# EAGLE design ufo (EAGLE 9.6.2)
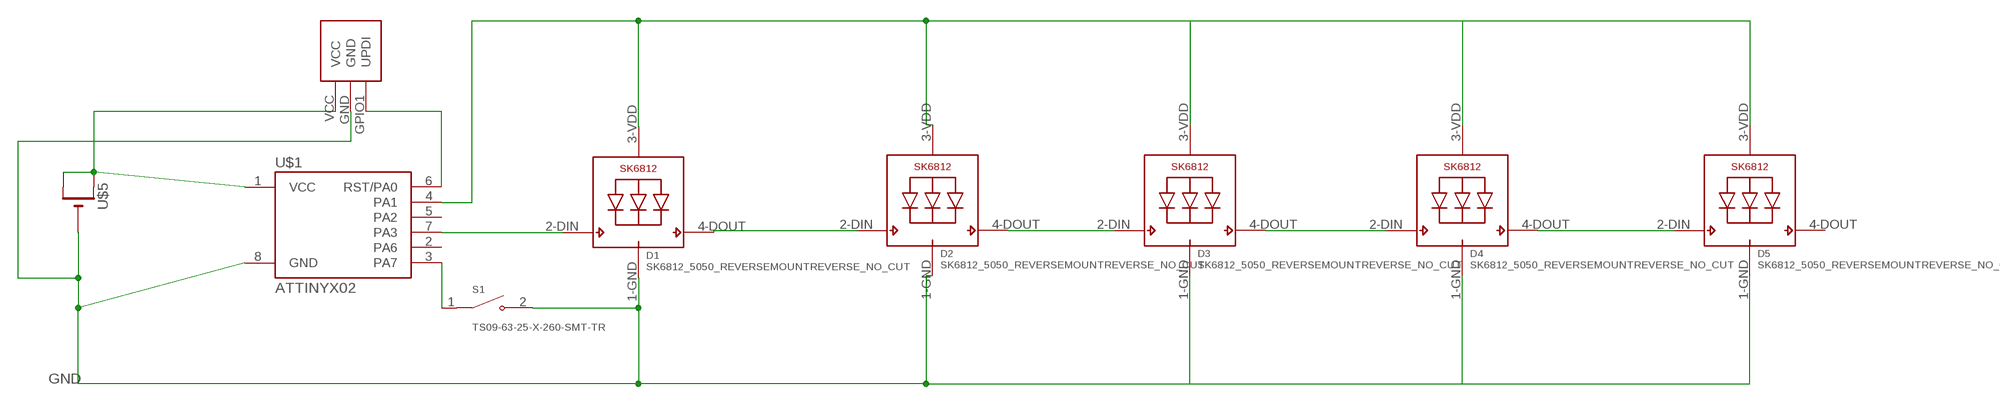
[diagram p0: schematic, sheet 1]

## Parts
D1  SK6812_5050_REVERSEMOUNTREVERSE_NO_CUT  [SK6812_REVERSE_NO_CUT]
D2  SK6812_5050_REVERSEMOUNTREVERSE_NO_CUT  [SK6812_REVERSE_NO_CUT]
D3  SK6812_5050_REVERSEMOUNTREVERSE_NO_CUT  [SK6812_REVERSE_NO_CUT]
D4  SK6812_5050_REVERSEMOUNTREVERSE_NO_CUT  [SK6812_REVERSE_NO_CUT]
D5  SK6812_5050_REVERSEMOUNTREVERSE_NO_CUT  [SK6812_REVERSE_NO_CUT]
S1  TS09-63-25-X-260-SMT-TR  [SW_TS09-63-25-X-260-SMT-TR]
U$1  ATTINYX02  [SOIC08_JEDEC_150MIL]
U$2  SAO  [SAO_SMD]
U$5  CR2032SMT  [CR2032-SMD]

## Nets
GND: D1.1-GND(GND) D2.1-GND(GND) D3.1-GND(GND) D4.1-GND(GND) D5.1-GND(GND) S1.2 U$1.8(GND) U$2.GND U$5.-
N$2: D1.4-DOUT(DO) D2.2-DIN(DI)
N$3: D1.2-DIN(DI) U$1.7(PA3)
N$5: D3.4-DOUT(DO) D4.2-DIN(DI)
N$6: D2.4-DOUT(DO) D3.2-DIN(DI)
N$7: S1.1 U$1.3(PA7)
N$8: D4.4-DOUT(DO) D5.2-DIN(DI)
N$110: U$1.6(RST/PA0) U$2.GPIO1(UPDI)
VCC1: U$1.1(VCC) U$2.VCC U$5.+$1(+) U$5.+$2(+1)
VDD1: D1.3-VDD(VDD) D2.3-VDD(VDD) D3.3-VDD(VDD) D4.3-VDD(VDD) D5.3-VDD(VDD) U$1.4(PA1)
Unconnected: D5.4-DOUT(DO) U$1.2(PA6) U$1.5(PA2)

## Library data of the parts
D1-D5 = mylibrary:SK6812_5050_REVERSEMOUNT
S1 = mylibrary:TS09-63-25-X-260-SMT-TR; MANUFACTURER: CUI Devices; MAXIMUM_PACKAGE_HEIGHT: 2.5 mm; PARTREV: 1.0; STANDARD: Manufacturer Recommendations
U$1 = mylibrary:ATTINYX02
U$2 = mylibrary:SAO
U$5 = adafruit:CR2032

## Board
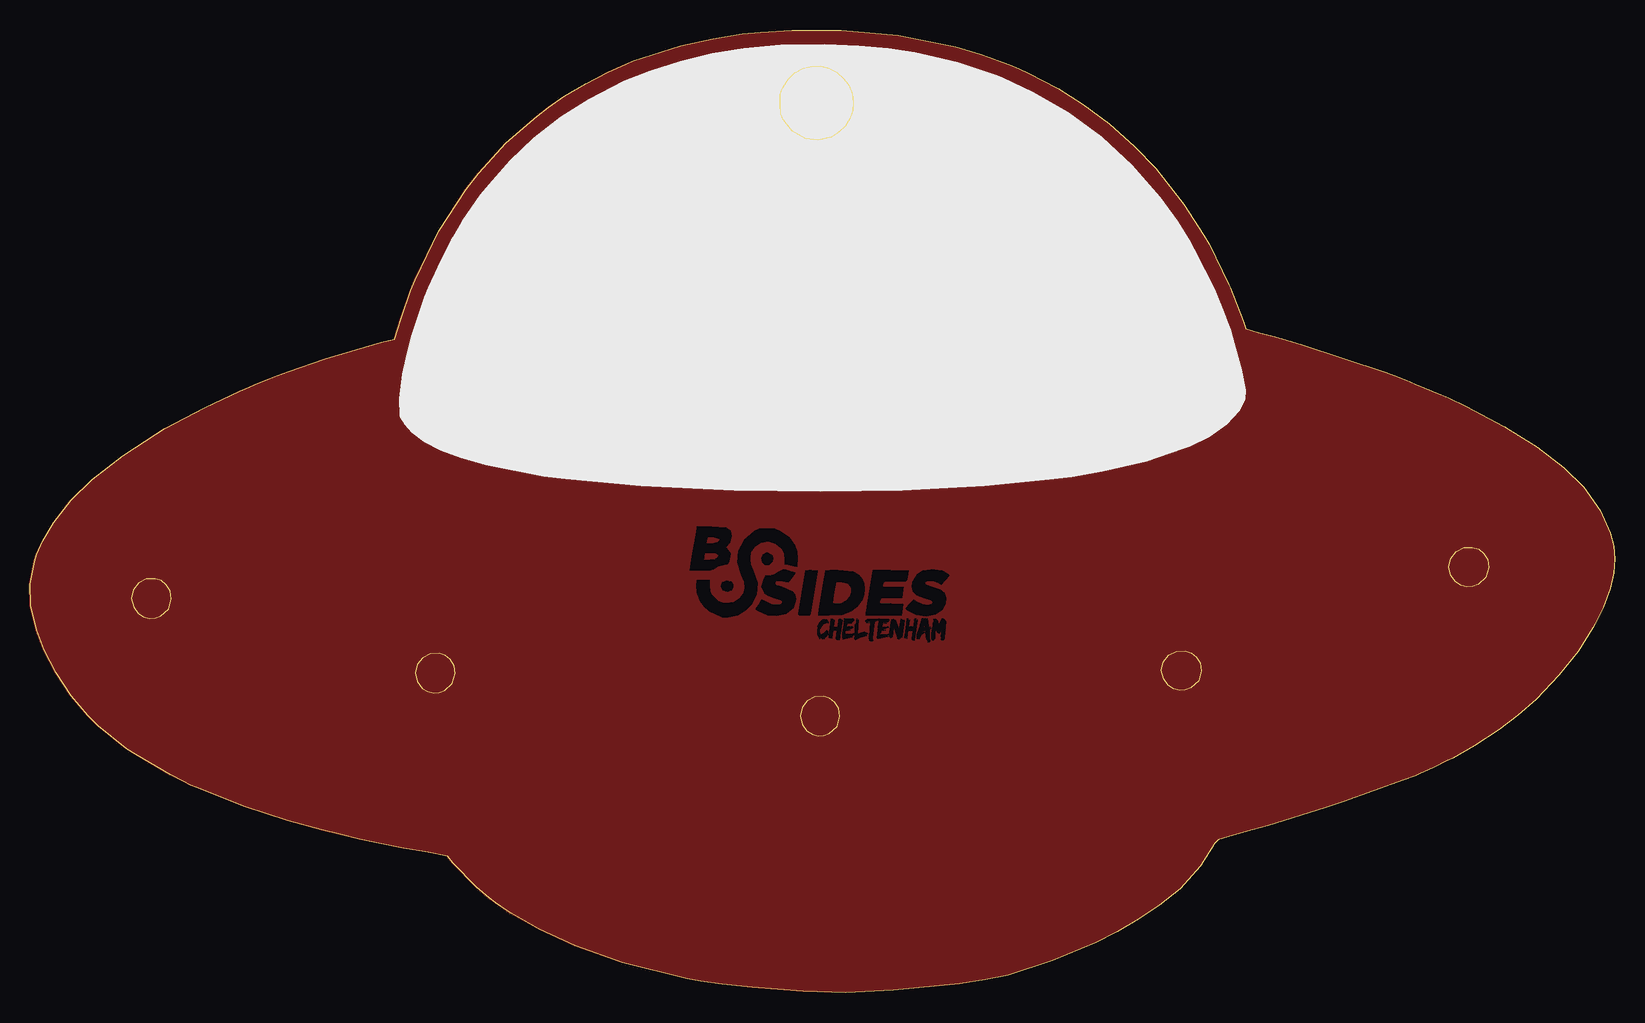
[diagram p1: board, top side]
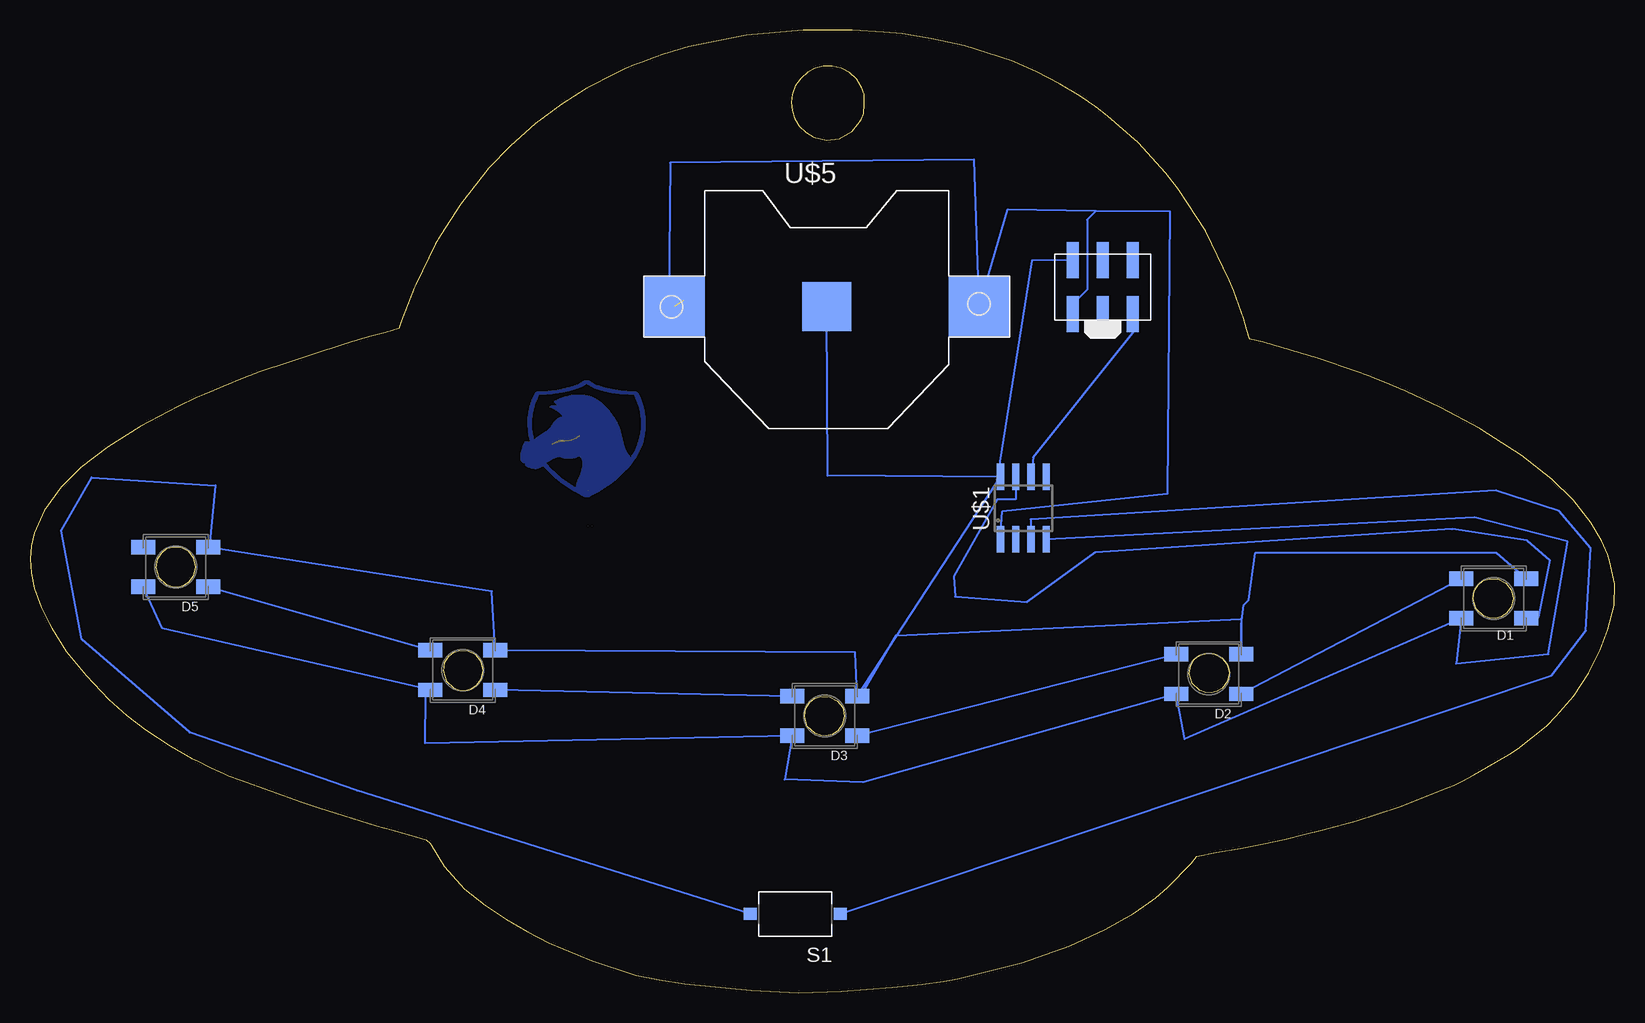
[diagram p2: board, bottom side, seen from below]

Size 132.05 x 80.26 mm. Coordinates in mm from the lower left corner, seen from the top.
Outline: 40.09,6.59 42.43,5.27 45.42,3.89 49.41,2.5 54.76,1.15 55.91,0.95 57.68,0.71 58.9,0.58 60.19,0.43 64.44,0.09 67.97,0 71.94,0.2 77.48,0.71 79.61,1.08 81.53,1.46 85.19,2.65 88.81,4.14 90.59,5.06 92.36,6.1 94.12,7.29 95.86,8.65 97.51,10.54 98.71,12.43 99.03,12.72 100.27,13.12 101.91,13.56 103.15,13.92 107.93,15.39 109.46,15.89 114.54,17.73 115.49,18.09 115.82,18.22 117.04,18.79 118.08,19.3 118.56,19.55 120.38,20.56 122.42,21.89 123.98,23.1 125.5,24.44 127.38,26.42 129.03,28.43 130.24,30.41 130.43,30.77 131.1,32.09 131.69,33.7 131.96,35 132.05,36.15 131.96,37.23 131.69,38.32 130.85,40.21 129.46,42.13 127.81,43.77 125.59,45.48 122.86,47.19 119.71,48.86 118.17,49.59 117.54,49.86 115.43,50.75 114.67,51.06 113.71,51.43 112.94,51.73 105.97,54.04 104.75,54.41 103.74,54.68 102.4,55.03 101.33,55.34 101.12,55.98 100.02,58.77 99.91,59.05 98.26,62.39 97.83,63.15 96.14,65.75 93.8,68.73 92.01,70.59 89.93,72.42 87.75,74.08 85.67,75.39 83.21,76.67 82.43,77.02 81.67,77.35 81.04,77.58 79.93,77.99 79.25,78.23 77.16,78.87 72.35,79.84 67.62,80.25 63.53,80.26 60.91,80.08 59.35,79.92 56.93,79.54 54.21,78.94 50.28,77.68 49.72,77.44 48.13,76.73 46.29,75.76 44.54,74.73 43.22,73.83 42.25,73.08 39.69,70.84 37.4,68.31 36.36,67 34.08,63.47 32.1,59.4 31.74,58.54 30.93,56.21 30.65,55.28 30.41,54.5 29.31,54.25 24.64,52.87 21.51,51.78 20.59,51.44 19.99,51.21 19.03,50.81 17.97,50.36 17.46,50.15 14.55,48.76 11.24,47.02 10.52,46.58 7.76,44.76 5.2,42.78 3.45,41.07 2,39.2 1.08,37.64 0.57,36.51 0.41,35.94 0,34.06 0.04,32.3 0.56,30.25 1.19,28.56 2.17,26.65 3.42,24.74 4.86,23.07 5.67,22.24 8.06,20.33 8.8,19.85 11.72,18.13 12.76,17.6 13.4,17.29 13.85,17.1 17.94,15.48 21.53,14.32 24.32,13.55 25.86,13.18 27.49,12.79 29.29,12.41 31.14,12.05 33.2,11.69 34.82,11.37 35.28,10.79 37.23,8.79 38.25,7.88 38.81,7.5 39.24,7.19 40.09,6.59
Outline: 40.09,6.59 40.09,6.59
Outline: 62.58,73.26 62.52,74.07 62.54,74.9 62.74,75.45 63.17,76.14 63.75,76.68 64.43,77.05 65.2,77.24 65.94,77.24 66.62,77.06 67.24,76.72 67.83,76.19 68.27,75.59 68.53,74.92 68.62,74.22 68.54,73.52 68.31,72.85 67.93,72.24 67.41,71.72 66.75,71.32 65.68,71.08 64.62,71.21 63.52,71.81 62.77,72.77 62.58,73.26
Outline: 8.62,33.58 8.46,32.87 8.63,32.16 9.03,31.6 9.49,31.33 9.97,31.21 10.44,31.23 10.91,31.41 11.55,31.99 11.78,32.82 11.68,33.47 11.35,34 10.94,34.34 10.43,34.5 9.7,34.47 9.06,34.14 8.62,33.58
Outline: 32.28,27.36 32.12,26.64 32.29,25.93 32.69,25.38 33.15,25.11 33.63,24.98 34.1,25.01 34.56,25.18 35.21,25.77 35.44,26.59 35.34,27.25 35.01,27.77 34.6,28.12 34.09,28.28 33.35,28.24 32.72,27.91 32.28,27.36
Outline: 64.34,23.78 64.18,23.07 64.35,22.36 64.75,21.8 65.21,21.53 65.69,21.41 66.16,21.43 66.63,21.61 67.27,22.19 67.5,23.02 67.4,23.67 67.07,24.2 66.66,24.54 66.15,24.7 65.41,24.67 64.78,24.34 64.34,23.78
Outline: 94.46,26.15 94.29,26.86 94.45,27.57 94.89,28.13 95.52,28.46 96.26,28.5 96.77,28.33 97.18,27.99 97.51,27.47 97.61,26.81 97.38,25.99 96.73,25.4 96.27,25.22 95.8,25.2 95.32,25.32 94.86,25.6 94.46,26.15
Outline: 118.41,34.78 118.23,35.49 118.4,36.2 118.84,36.76 119.47,37.09 120.21,37.12 120.71,36.96 121.13,36.62 121.46,36.1 121.55,35.44 121.32,34.62 120.68,34.03 120.22,33.85 119.74,33.83 119.27,33.95 118.8,34.23 118.41,34.78
Copper layers (1*16): Top 0.035mm / dielectric 1.5mm / Bottom 0.035mm
Design rules "default *": minimum track width 6mil, minimum drill 0.35mm, track to track 6mil, track to pad 6mil, pad to pad 6mil, via to via 6mil, smd to smd 6mil, copper to edge 0mil, drill to drill 6mil, minimum pad ring 10mil, minimum via ring 8mil, stop-mask expansion 4mil, vias tented up to drill 0mil, thermal gap 10mil
tRestrict: area 55.5,31.3 to 64,38.7; area 69.6,31.5 to 73.2,35.2; area 65.7,31.5 to 69.6,35.2; area 64,31.5 to 65.6,35.2; area 60.5,31.4 to 63.8,35.2; area 60.9,35.7 to 61.9,36.6; area 57.6,33.4 to 58.6,34.4; area 73,31.4 to 76.6,35.2; area 65.6,29.5 to 66.6,31.1; area 66.7,30.3 to 66.7,30.4; area 66.6,29.4 to 67.7,31.2; area 67.7,29.5 to 68.7,31.2; area 68.7,29.4 to 69.8,31.2; area 70,29.5 to 70,30; area 69.6,29.3 to 70.8,31.2; area 70.6,29.5 to 71.6,31.2; area 71.6,29.4 to 72.9,31.1; area 72.9,29.4 to 74,31.2; area 73.9,29.2 to 75.1,31.2; area 75.1,29.4 to 76.3,31.2; area 55,35.2 to 58.5,38.8; 208 lines
bRestrict: area 81.1,44.7 to 90.2,50.7; area 86.1,42.2 to 88.9,44.7

### Footprints (pad centres in the part's own frame; a part is rotated, then mirrored left to right if it is on the bottom)
SK6812_REVERSE_NO_CUT = smd 2 x 1.2: 1-GND -2.7,-1.65; 2-DIN -2.7,1.65; 3-VDD 2.7,1.65; 4-DOUT 2.7,-1.65
SW_TS09-63-25-X-260-SMT-TR = smd 1.1 x 1: 1 -3.75,0; 2 3.75,0
SOIC08_JEDEC_150MIL = smd 0.6 x 2.2: 1 -1.905,-2.6; 2 -0.635,-2.6; 3 0.635,-2.6; 4 1.905,-2.6; 5 1.905,2.6; 6 0.635,2.6; 7 -0.635,2.6; 8 -1.905,2.6
SAO_SMD = smd 1 x 3: GND 5.5,1.5; GPIO1 0.5,6; GPIO2 0.5,1.5; SCL 3,1.5; SDA 3,6; VCC 5.5,6
CR2032-SMD = smd 5.08 x 5.08: +$1 -12.7,0; +$2 12.7,0 | smd 4.064 x 4.064: - 0,0

### Placement (x,y rotation side)
D1  10.06,32.85 180 bottom
D2  33.82,26.55 180 bottom
D3  65.82,23.06 180 bottom
D4  95.98,26.88 180 bottom
D5  119.92,35.48 180 bottom
S1  68.28,6.55 180 bottom
U$1  49.28,40.39 0 bottom
U$2  39.65,62.55 180 bottom
U$5  65.65,57.19 0 bottom

### Tracks (layer width: path | path; a pad name or v marks a point on that pad's centre or on a via)
GND
  Bottom 0.152: D1.1-GND 9.85,36.67 29.94,36.67 30.49,32.73 30.89,32.33 31.12,30.7 D2.1-GND 31.12,31.16 59.87,29.8 62.46,25.37 D3.1-GND | D3.1-GND 51.54,42.44 | 51.54,42.44 U$1.8 65.57,43.09 65.65,56.88 | 65.65,56.88 U$5.- | 66.24,57.01 65.65,56.88 | D3.1-GND 63.3,28.37 D4.1-GND 93.57,33.46 117.12,37.11 | 117.12,37.11 D5.1-GND | S1.2 104.82,16.86 118.75,21.68 127.72,29.44 129.47,38.54 126.92,42.96 116.61,42.29 117.12,37.11 | U$2.GND 48.56,61.03 51.54,42.44
N$2
  Bottom 0.152: D1.4-DOUT D2.2-DIN
N$3
  Bottom 0.152: U$1.7 49.91,41.12 51.44,41.12 55.07,34.7 54.96,33.01 48.97,32.55 43.29,36.71 13.54,38.64 7.3,37.71 5.39,36.06 6.35,31.3 D1.2-DIN
N$5
  Bottom 0.152: D3.4-DOUT D4.2-DIN
N$6
  Bottom 0.152: D2.4-DOUT D3.2-DIN
N$7
  Bottom 0.152: S1.1 5.25,26.45 2.39,30.16 2,37.05 4.64,40.15 9.9,41.88 48.66,39.45 48.64,39.33 U$1.3
N$8
  Bottom 0.152: D4.4-DOUT D5.2-DIN
N$9
  pour Bottom: 80.83,48.05 80.81,47.51 80.82,46.95 80.86,46.55 80.94,46.16 81.04,45.79 81.18,45.42 81.35,45.05 81.55,44.69 81.78,44.34 82.04,44 82.29,43.7 82.6,43.38 82.93,43.06 83.25,42.78 83.72,42.41 84.23,42.06 84.79,41.71 85.37,41.39 85.49,41.32 85.67,41.32 85.84,41.32 85.97,41.39 85.97,41.39 86.65,41.77 87.24,42.15 87.78,42.54 88.28,42.95 88.74,43.4 89.15,43.83 89.23,43.93 89.33,43.87 89.52,43.77 89.71,43.69 89.88,43.64 90.01,43.63 90.27,43.69 90.56,43.81 90.68,43.88 90.74,43.95 90.75,44.02 90.74,44.09 90.74,44.11 90.76,44.11 90.9,44.16 91,44.24 91.06,44.33 91.1,44.45 91.12,44.55 91.13,44.69 91.11,44.93 91.05,45.22 90.94,45.59 90.82,45.86 90.77,45.92 90.7,45.95 90.62,45.95 90.54,45.9 90.5,45.87 90.34,45.97 90.37,46.09 90.45,46.44 90.5,46.83 90.52,47.35 90.51,47.89 90.46,48.39 90.35,48.88 90.21,49.34 90.02,49.78 89.94,49.95 89.85,50.03 89.77,50.12 89.6,50.12 88.85,50.17 88.12,50.25 87.42,50.38 86.8,50.55 86.52,50.65 86.28,50.75 86.07,50.86 85.9,50.97 85.83,51.03 85.49,51.03 85.46,51 85.32,50.9 85.15,50.8 84.86,50.67 84.53,50.55 84.16,50.44 83.75,50.35 83.31,50.27 82.84,50.2 82.34,50.16 81.81,50.13 81.56,50.12 81.47,50.03 81.36,49.89 81.25,49.66 81.1,49.29 80.98,48.89 80.89,48.48
N$110
  Bottom 0.152: U$2.GPIO1 40.15,55 48.45,44.61 U$1.6
N$111
  pour Top: -0.03,32.29 -0.07,34.05 0.33,35.93 0.49,36.5 1.01,37.63 1.92,39.19 3.37,41.06 5.13,42.77 7.68,44.75 10.44,46.57 11.16,47.01 14.48,48.75 17.39,50.14 17.89,50.35 18.95,50.8 19.91,51.2 20.51,51.43 21.44,51.77 24.57,52.86 29.24,54.24 30.34,54.49 30.57,55.27 30.85,56.2 31.67,58.53 32.02,59.39 34,63.46 36.29,66.99 37.33,68.3 39.61,70.83 42.18,73.07 43.14,73.82 44.46,74.72 46.22,75.75 48.06,76.72 49.64,77.43 50.2,77.67 54.14,78.93 56.85,79.53 59.27,79.91 60.84,80.07 63.46,80.25 67.55,80.24 72.27,79.83 77.08,78.86 79.17,78.22 79.85,77.98 80.97,77.58 81.59,77.34 82.35,77.02 83.14,76.66 85.59,75.38 87.67,74.07 89.85,72.41 91.94,70.58 93.73,68.72 96.07,65.74 97.76,63.14 98.19,62.38 99.83,59.04 99.94,58.77 101.04,55.97 101.25,55.33 102.33,55.02 103.67,54.67 104.67,54.4 105.89,54.04 112.87,51.72 113.63,51.42 114.6,51.05 115.36,50.74 117.47,49.85 118.1,49.58 119.64,48.85 122.79,47.18 125.51,45.47 127.74,43.76 129.39,42.12 130.78,40.2 131.62,38.31 131.89,37.22 131.98,36.14 131.89,34.99 131.61,33.69 131.03,32.08 130.35,30.76 130.16,30.4 128.95,28.42 127.31,26.41 125.43,24.43 123.91,23.09 122.34,21.88 120.3,20.55 118.49,19.54 118.01,19.29 116.96,18.78 115.75,18.21 115.41,18.08 114.46,17.72 109.38,15.88 107.86,15.38 103.08,13.91 101.84,13.55 100.2,13.11 98.96,12.72 98.63,12.42 97.44,10.53 95.78,8.64 94.04,7.28 92.29,6.09 90.52,5.05 88.73,4.13 85.12,2.64 81.46,1.45 79.53,1.07 77.41,0.71 71.87,0.19 67.9,-0.01 64.36,0.08 60.11,0.42 58.83,0.57 57.61,0.7 55.84,0.94 54.68,1.14 49.33,2.49 45.34,3.88 42.36,5.26 40.01,6.58 40.01,6.58 39.16,7.18 38.74,7.5 38.18,7.87 37.16,8.78 35.2,10.78 34.75,11.36 33.13,11.68 31.07,12.04 29.21,12.4 27.42,12.78 25.78,13.17 24.25,13.54 21.46,14.31 17.87,15.47 13.78,17.09 13.33,17.28 12.68,17.59 11.65,18.12 8.73,19.85 7.99,20.32 5.59,22.24 4.79,23.06 3.35,24.73 2.1,26.64 1.12,28.56 0.48,30.24
VCC1  (1 unrouted)
  Bottom 0.152: 77.63,57.68 78.57,56.21 78.83,57.68 78.7,69.19 53.39,69.46 U$5.+$2 50.57,65.31 43.29,65.18 | 43.29,65.18 43.21,65.18 43.95,64.43 43.95,58.6 45.15,57.41 U$2.VCC | 43.29,65.18 37.05,65.15 37.27,41.57 51.02,40.12 51.17,38.39 51.18,38.39 U$1.1
VDD1
  Bottom 0.152: D5.3-VDD 121.01,30.38 D4.3-VDD 99.05,24.82 99.13,20.79 D3.3-VDD 68.53,21.4 69.16,17.77 62.65,17.54 D2.3-VDD 35.83,21.14 D1.3-VDD 13.2,27.43 5.52,28.23 3.91,37.6 11.66,39.61 U$1.4

### Text on the board
bDocu: Badges by: | DevSecOps